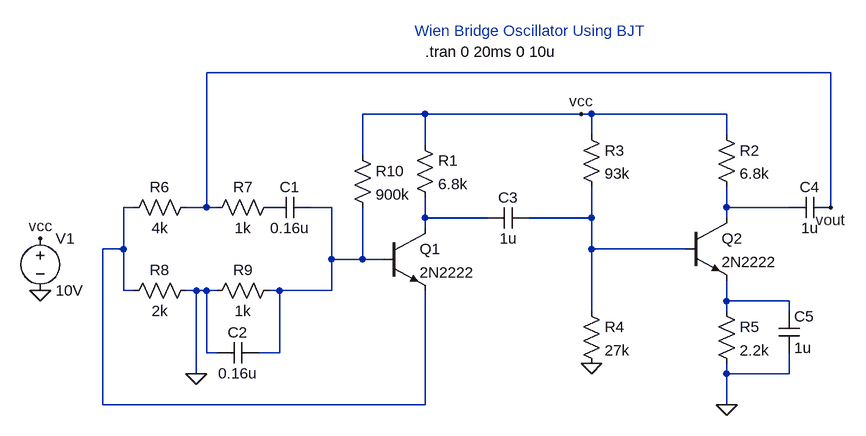
[diagram p0: schematic wien_bridge_oscillator_BJT.asc]
wien_bridge_oscillator_BJT.asc, the LTspice schematic file:
Version 4.1
SHEET 1 1228 680
WIRE 1184 -96 224 -96
WIRE 560 -32 464 -32
WIRE 800 -32 560 -32
WIRE 816 -32 800 -32
WIRE 1024 -32 816 -32
WIRE 816 0 816 -32
WIRE 1024 0 1024 -32
WIRE 560 16 560 -32
WIRE 464 32 464 -32
WIRE 112 112 96 112
WIRE 224 112 224 -96
WIRE 224 112 192 112
WIRE 240 112 224 112
WIRE 416 112 384 112
WIRE 1024 112 1024 80
WIRE 1120 112 1024 112
WIRE 1184 112 1184 -96
WIRE 560 128 560 96
WIRE 656 128 560 128
WIRE 816 128 816 80
WIRE 816 128 720 128
WIRE 1024 128 1024 112
WIRE 560 144 560 128
WIRE 96 176 96 112
WIRE 96 176 64 176
WIRE 816 176 816 128
WIRE 960 176 816 176
WIRE 416 192 416 112
WIRE 464 192 464 112
WIRE 464 192 416 192
WIRE 496 192 464 192
WIRE 96 240 96 176
WIRE 112 240 96 240
WIRE 208 240 192 240
WIRE 224 240 208 240
WIRE 240 240 224 240
WIRE 336 240 320 240
WIRE 416 240 416 192
WIRE 416 240 336 240
WIRE 1024 256 1024 224
WIRE 1120 256 1024 256
WIRE 816 272 816 176
WIRE 1024 272 1024 256
WIRE 1120 272 1120 256
WIRE 224 336 224 240
WIRE 240 336 224 336
WIRE 336 336 336 240
WIRE 336 336 304 336
WIRE 208 368 208 240
WIRE 1024 368 1024 352
WIRE 1120 368 1120 336
WIRE 1120 368 1024 368
WIRE 64 416 64 176
WIRE 560 416 560 240
WIRE 560 416 64 416
WIRE 1024 416 1024 368
FLAG -32 160 vcc
FLAG 208 368 0
FLAG 800 -32 vcc
FLAG 816 352 0
FLAG 1024 416 0
FLAG 1184 112 vout
FLAG -32 240 0
SYMBOL voltage -32 144 R0
WINDOW 123 0 0 Left 0
WINDOW 39 0 0 Left 0
SYMATTR InstName V1
SYMATTR Value 10V
SYMBOL npn 496 144 R0
SYMATTR InstName Q1
SYMATTR Value 2N2222
SYMBOL npn 960 128 R0
SYMATTR InstName Q2
SYMATTR Value 2N2222
SYMBOL res 544 0 R0
SYMATTR InstName R1
SYMATTR Value 6.8k
SYMBOL res 1008 -16 R0
SYMATTR InstName R2
SYMATTR Value 6.8k
SYMBOL res 800 -16 R0
SYMATTR InstName R3
SYMATTR Value 93k
SYMBOL res 800 256 R0
SYMATTR InstName R4
SYMATTR Value 27k
SYMBOL res 1008 256 R0
SYMATTR InstName R5
SYMATTR Value 2.2k
SYMBOL res 208 96 R90
WINDOW 0 0 56 VBottom 2
WINDOW 3 32 56 VTop 2
SYMATTR InstName R6
SYMATTR Value 4k
SYMBOL res 336 96 R90
WINDOW 0 0 56 VBottom 2
WINDOW 3 32 56 VTop 2
SYMATTR InstName R7
SYMATTR Value 1k
SYMBOL res 208 224 R90
WINDOW 0 0 56 VBottom 2
WINDOW 3 32 56 VTop 2
SYMATTR InstName R8
SYMATTR Value 2k
SYMBOL res 336 224 R90
WINDOW 0 0 56 VBottom 2
WINDOW 3 32 56 VTop 2
SYMATTR InstName R9
SYMATTR Value 1k
SYMBOL cap 384 96 R90
WINDOW 0 0 32 VBottom 2
WINDOW 3 32 32 VTop 2
SYMATTR InstName C1
SYMATTR Value 0.16u
SYMBOL cap 304 320 R90
WINDOW 0 0 32 VBottom 2
WINDOW 3 32 32 VTop 2
SYMATTR InstName C2
SYMATTR Value 0.16u
SYMBOL cap 720 112 R90
WINDOW 0 0 32 VBottom 2
WINDOW 3 32 32 VTop 2
SYMATTR InstName C3
SYMATTR Value 1u
SYMBOL cap 1184 96 R90
WINDOW 0 0 32 VBottom 2
WINDOW 3 32 32 VTop 2
SYMATTR InstName C4
SYMATTR Value 1u
SYMBOL cap 1104 272 R0
SYMATTR InstName C5
SYMATTR Value 1u
SYMBOL res 448 16 R0
SYMATTR InstName R10
SYMATTR Value 900k
TEXT 560 -128 Left 2 !.tran 0 20ms 0 10u
TEXT 544 -160 Left 2 ;Wien Bridge Oscillator Using BJT

The netlist it stands for:
* wien_bridge_oscillator_BJT.asc
V1 vcc 0 10V
Q1 N004 N002 N001 0 2N2222
Q2 N003 N005 N006 0 2N2222
R1 vcc N004 6.8k
R2 vcc N003 6.8k
R3 vcc N005 93k
R4 N005 0 27k
R5 N006 0 2.2k
R6 vout N001 4k
R7 P001 vout 1k
R8 0 N001 2k
R9 N002 0 1k
C1 N002 P001 0.16u
C2 N002 0 0.16u
C3 N005 N004 1u
C4 vout N003 1u
C5 N006 0 1u
R10 vcc N002 900k
.model NPN NPN
.model PNP PNP
.lib standard.bjt
.tran 0 20ms 0 10u
* Wien Bridge Oscillator Using BJT
.backanno
.end